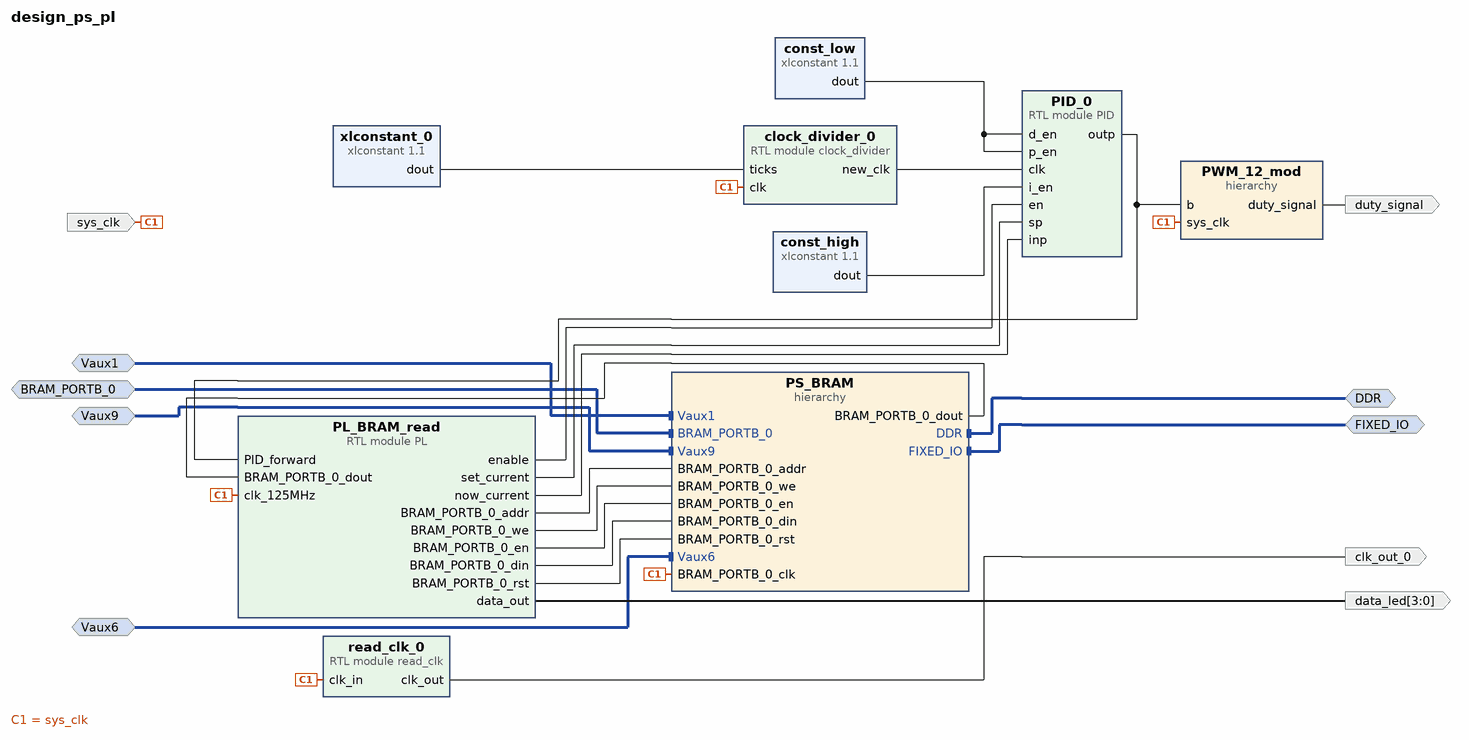
[diagram p0: block diagram of the top level]
# Vivado block design design_ps_pl, xc7z020clg400-1, Vivado 2019.1
create_bd_design design_ps_pl

create_bd_intf_port -mode Slave -vlnv xilinx.com:interface:bram_rtl:1.0 BRAM_PORTB_0
set_property -dict {CONFIG.MASTER_TYPE BRAM_CTRL} [get_bd_intf_ports BRAM_PORTB_0]
create_bd_intf_port -mode Master -vlnv xilinx.com:interface:ddrx_rtl:1.0 DDR
create_bd_intf_port -mode Master -vlnv xilinx.com:display_processing_system7:fixedio_rtl:1.0 FIXED_IO
create_bd_intf_port -mode Slave -vlnv xilinx.com:interface:diff_analog_io_rtl:1.0 Vaux1
create_bd_intf_port -mode Slave -vlnv xilinx.com:interface:diff_analog_io_rtl:1.0 Vaux6
create_bd_intf_port -mode Slave -vlnv xilinx.com:interface:diff_analog_io_rtl:1.0 Vaux9
create_bd_port -dir I sys_clk
create_bd_port -dir O -from 3 -to 0 data_led
create_bd_port -dir O duty_signal
create_bd_port -dir O clk_out_0

create_bd_cell -type hier PS_BRAM
create_bd_cell -type ip -vlnv xilinx.com:ip:xlconstant:1.1 const_high
create_bd_cell -type ip -vlnv xilinx.com:ip:xlconstant:1.1 const_low
set_property -dict {CONFIG.CONST_VAL 0} [get_bd_cells const_low]
create_bd_cell -type hier PWM_12_mod
create_bd_cell -type module -reference PL PL_BRAM_read
create_bd_cell -type module -reference PID PID_0
create_bd_cell -type module -reference read_clk read_clk_0
create_bd_cell -type module -reference clock_divider clock_divider_0
create_bd_cell -type ip -vlnv xilinx.com:ip:xlconstant:1.1 xlconstant_0
set_property -dict {CONFIG.CONST_VAL 4095 CONFIG.CONST_WIDTH 32} [get_bd_cells xlconstant_0]

# ---- hierarchy /PS_BRAM ----
current_bd_instance /PS_BRAM
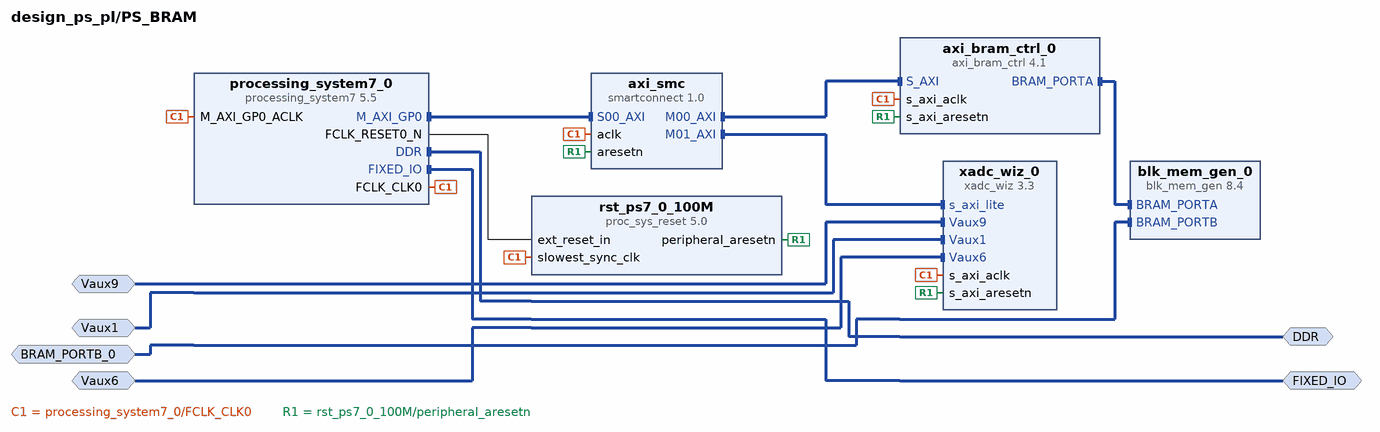
[diagram p1: block diagram inside /PS_BRAM]
create_bd_intf_pin -mode Master -vlnv xilinx.com:interface:ddrx_rtl:1.0 DDR
create_bd_intf_pin -mode Master -vlnv xilinx.com:display_processing_system7:fixedio_rtl:1.0 FIXED_IO
create_bd_intf_pin -mode Slave -vlnv xilinx.com:interface:bram_rtl:1.0 BRAM_PORTB_0
create_bd_intf_pin -mode Slave -vlnv xilinx.com:interface:diff_analog_io_rtl:1.0 Vaux1
create_bd_intf_pin -mode Slave -vlnv xilinx.com:interface:diff_analog_io_rtl:1.0 Vaux6
create_bd_intf_pin -mode Slave -vlnv xilinx.com:interface:diff_analog_io_rtl:1.0 Vaux9

create_bd_cell -type ip -vlnv xilinx.com:ip:axi_bram_ctrl:4.1 axi_bram_ctrl_0
set_property -dict {CONFIG.SINGLE_PORT_BRAM 1} [get_bd_cells axi_bram_ctrl_0]
create_bd_cell -type ip -vlnv xilinx.com:ip:smartconnect:1.0 axi_smc
set_property -dict {CONFIG.NUM_MI 2 CONFIG.NUM_SI 1} [get_bd_cells axi_smc]
create_bd_cell -type ip -vlnv xilinx.com:ip:processing_system7:5.5 processing_system7_0
set_property -dict [list \
  CONFIG.PCW_APU_PERIPHERAL_FREQMHZ 650 \
  CONFIG.PCW_CRYSTAL_PERIPHERAL_FREQMHZ 50 \
  CONFIG.PCW_ENET0_ENET0_IO {MIO 16 .. 27} \
  CONFIG.PCW_ENET0_GRP_MDIO_ENABLE 1 \
  CONFIG.PCW_ENET0_GRP_MDIO_IO {MIO 52 .. 53} \
  CONFIG.PCW_ENET0_PERIPHERAL_ENABLE 1 \
  CONFIG.PCW_ENET0_RESET_ENABLE 1 \
  CONFIG.PCW_ENET0_RESET_IO {MIO 9} \
  CONFIG.PCW_ENET_RESET_ENABLE 1 \
  CONFIG.PCW_ENET_RESET_SELECT {Share reset pin} \
  CONFIG.PCW_FPGA0_PERIPHERAL_FREQMHZ 100 \
  CONFIG.PCW_FPGA1_PERIPHERAL_FREQMHZ 50 \
  CONFIG.PCW_GPIO_MIO_GPIO_ENABLE 1 \
  CONFIG.PCW_GPIO_MIO_GPIO_IO MIO \
  CONFIG.PCW_I2C_RESET_ENABLE 1 \
  CONFIG.PCW_M_AXI_GP0_FREQMHZ 10 \
  CONFIG.PCW_PERIPHERAL_BOARD_PRESET None \
  CONFIG.PCW_PRESET_BANK1_VOLTAGE {LVCMOS 1.8V} \
  CONFIG.PCW_QSPI_GRP_FBCLK_ENABLE 1 \
  CONFIG.PCW_QSPI_GRP_FBCLK_IO {MIO 8} \
  CONFIG.PCW_QSPI_GRP_SINGLE_SS_ENABLE 1 \
  CONFIG.PCW_QSPI_GRP_SINGLE_SS_IO {MIO 1 .. 6} \
  CONFIG.PCW_QSPI_PERIPHERAL_ENABLE 1 \
  CONFIG.PCW_QSPI_QSPI_IO {MIO 1 .. 6} \
  CONFIG.PCW_SD0_GRP_CD_ENABLE 1 \
  CONFIG.PCW_SD0_GRP_CD_IO {MIO 47} \
  CONFIG.PCW_SD0_GRP_WP_ENABLE 0 \
  CONFIG.PCW_SD0_PERIPHERAL_ENABLE 1 \
  CONFIG.PCW_SD0_SD0_IO {MIO 40 .. 45} \
  CONFIG.PCW_SDIO_PERIPHERAL_FREQMHZ 50 \
  CONFIG.PCW_SINGLE_QSPI_DATA_MODE x4 \
  CONFIG.PCW_UART0_PERIPHERAL_ENABLE 1 \
  CONFIG.PCW_UART0_UART0_IO {MIO 14 .. 15} \
  CONFIG.PCW_UART1_PERIPHERAL_ENABLE 0 \
  CONFIG.PCW_UART_PERIPHERAL_FREQMHZ 100 \
  CONFIG.PCW_UIPARAM_DDR_BUS_WIDTH {16 Bit} \
  CONFIG.PCW_UIPARAM_DDR_FREQ_MHZ 525 \
  CONFIG.PCW_UIPARAM_DDR_PARTNO {MT41J256M16 RE-125} \
  CONFIG.PCW_USB0_PERIPHERAL_ENABLE 1 \
  CONFIG.PCW_USB0_RESET_ENABLE 1 \
  CONFIG.PCW_USB0_RESET_IO {MIO 46} \
  CONFIG.PCW_USB0_USB0_IO {MIO 28 .. 39} \
  CONFIG.PCW_USB_RESET_ENABLE 1 \
  CONFIG.PCW_USB_RESET_SELECT {Share reset pin} \
] [get_bd_cells processing_system7_0]
# 481 more settings of processing_system7_0 are not shown: defaults, MIO pin electricals, DDR timing, and values the tool derives
create_bd_cell -type ip -vlnv xilinx.com:ip:blk_mem_gen:8.4 blk_mem_gen_0
set_property -dict [list \
  CONFIG.Enable_B Use_ENB_Pin \
  CONFIG.Memory_Type True_Dual_Port_RAM \
  CONFIG.Port_B_Clock 100 \
  CONFIG.Port_B_Enable_Rate 100 \
  CONFIG.Port_B_Write_Rate 50 \
  CONFIG.Use_RSTB_Pin true \
] [get_bd_cells blk_mem_gen_0]
create_bd_cell -type ip -vlnv xilinx.com:ip:proc_sys_reset:5.0 rst_ps7_0_100M
create_bd_cell -type ip -vlnv xilinx.com:ip:xadc_wiz:3.3 xadc_wiz_0
set_property -dict [list \
  CONFIG.CHANNEL_AVERAGING 16 \
  CONFIG.CHANNEL_ENABLE_VAUXP1_VAUXN1 true \
  CONFIG.CHANNEL_ENABLE_VAUXP6_VAUXN6 true \
  CONFIG.CHANNEL_ENABLE_VAUXP9_VAUXN9 true \
  CONFIG.CHANNEL_ENABLE_VP_VN true \
  CONFIG.ENABLE_VCCDDRO_ALARM false \
  CONFIG.ENABLE_VCCPAUX_ALARM false \
  CONFIG.ENABLE_VCCPINT_ALARM false \
  CONFIG.EXTERNAL_MUX_CHANNEL VP_VN \
  CONFIG.OT_ALARM false \
  CONFIG.SEQUENCER_MODE Continuous \
  CONFIG.SINGLE_CHANNEL_SELECTION TEMPERATURE \
  CONFIG.USER_TEMP_ALARM false \
  CONFIG.VCCAUX_ALARM false \
  CONFIG.VCCINT_ALARM false \
  CONFIG.XADC_STARUP_SELECTION channel_sequencer \
] [get_bd_cells xadc_wiz_0]

# ---- hierarchy /PWM_12_mod ----
current_bd_instance /PWM_12_mod
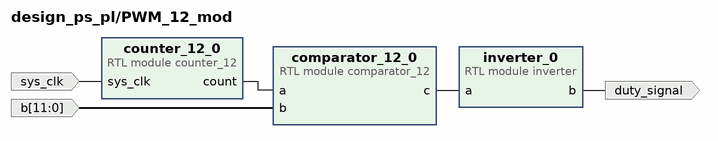
[diagram p2: block diagram inside /PWM_12_mod]
create_bd_pin -dir I -type clk sys_clk
create_bd_pin -dir O duty_signal
create_bd_pin -dir I -from 11 -to 0 b

create_bd_cell -type module -reference counter_12 counter_12_0
create_bd_cell -type module -reference inverter inverter_0
create_bd_cell -type module -reference comparator_12 comparator_12_0

# ---- connections ----

current_bd_instance /PS_BRAM
connect_bd_intf_net [get_bd_intf_pins Vaux9] [get_bd_intf_pins xadc_wiz_0/Vaux9]
connect_bd_intf_net [get_bd_intf_pins axi_smc/M01_AXI] [get_bd_intf_pins xadc_wiz_0/s_axi_lite]
connect_bd_intf_net [get_bd_intf_pins DDR] [get_bd_intf_pins processing_system7_0/DDR]
connect_bd_intf_net [get_bd_intf_pins axi_bram_ctrl_0/BRAM_PORTA] [get_bd_intf_pins blk_mem_gen_0/BRAM_PORTA]
connect_bd_intf_net [get_bd_intf_pins FIXED_IO] [get_bd_intf_pins processing_system7_0/FIXED_IO]
connect_bd_intf_net [get_bd_intf_pins axi_smc/M00_AXI] [get_bd_intf_pins axi_bram_ctrl_0/S_AXI]
connect_bd_intf_net [get_bd_intf_pins processing_system7_0/M_AXI_GP0] [get_bd_intf_pins axi_smc/S00_AXI]
connect_bd_intf_net [get_bd_intf_pins Vaux1] [get_bd_intf_pins xadc_wiz_0/Vaux1]
connect_bd_intf_net -intf_net BRAM_PORTB_0_1 [get_bd_intf_pins BRAM_PORTB_0] [get_bd_intf_pins blk_mem_gen_0/BRAM_PORTB]
connect_bd_intf_net [get_bd_intf_pins Vaux6] [get_bd_intf_pins xadc_wiz_0/Vaux6]
connect_bd_net [get_bd_pins processing_system7_0/FCLK_CLK0] \
  [get_bd_pins processing_system7_0/M_AXI_GP0_ACLK] [get_bd_pins axi_smc/aclk] [get_bd_pins axi_bram_ctrl_0/s_axi_aclk] \
  [get_bd_pins rst_ps7_0_100M/slowest_sync_clk] [get_bd_pins xadc_wiz_0/s_axi_aclk]
connect_bd_net [get_bd_pins rst_ps7_0_100M/peripheral_aresetn] \
  [get_bd_pins axi_bram_ctrl_0/s_axi_aresetn] [get_bd_pins axi_smc/aresetn] [get_bd_pins xadc_wiz_0/s_axi_aresetn]
connect_bd_net [get_bd_pins processing_system7_0/FCLK_RESET0_N] [get_bd_pins rst_ps7_0_100M/ext_reset_in]
set_property HDL_ATTRIBUTE.BMM_INFO_ADDRESS_SPACE {byte  0x40000000 32 > design_ps_pl PS_BRAM/blk_mem_gen_0} [get_bd_cells axi_bram_ctrl_0]
set_property HDL_ATTRIBUTE.KEEP_HIERARCHY yes [get_bd_cells axi_bram_ctrl_0]
set_property HDL_ATTRIBUTE.BMM_INFO_PROCESSOR {arm > design_ps_pl PS_BRAM/axi_bram_ctrl_0} [get_bd_cells processing_system7_0]
set_property HDL_ATTRIBUTE.KEEP_HIERARCHY yes [get_bd_cells processing_system7_0]

current_bd_instance /PWM_12_mod
connect_bd_net [get_bd_pins counter_12_0/count] [get_bd_pins comparator_12_0/a]
connect_bd_net [get_bd_pins comparator_12_0/c] [get_bd_pins inverter_0/a]
connect_bd_net -net clk_125MHz_0_1 [get_bd_pins sys_clk] [get_bd_pins counter_12_0/sys_clk]
connect_bd_net [get_bd_pins inverter_0/b] [get_bd_pins duty_signal]
connect_bd_net -net PID_0_outp [get_bd_pins b] [get_bd_pins comparator_12_0/b]

current_bd_instance /
connect_bd_intf_net -intf_net processing_system7_0_DDR [get_bd_intf_ports DDR] [get_bd_intf_pins PS_BRAM/DDR]
connect_bd_intf_net -intf_net processing_system7_0_FIXED_IO [get_bd_intf_ports FIXED_IO] [get_bd_intf_pins PS_BRAM/FIXED_IO]
connect_bd_intf_net -intf_net Vaux1_1 [get_bd_intf_ports Vaux1] [get_bd_intf_pins PS_BRAM/Vaux1]
connect_bd_intf_net -intf_net BRAM_PORTB_0_1 [get_bd_intf_ports BRAM_PORTB_0] [get_bd_intf_pins PS_BRAM/BRAM_PORTB_0]
connect_bd_intf_net -intf_net Vaux9_1 [get_bd_intf_ports Vaux9] [get_bd_intf_pins PS_BRAM/Vaux9]
connect_bd_intf_net -intf_net Vaux6_1 [get_bd_intf_ports Vaux6] [get_bd_intf_pins PS_BRAM/Vaux6]
connect_bd_net -net ps_BRAM_PORTB_0_dout [get_bd_pins PS_BRAM/BRAM_PORTB_0_dout] [get_bd_pins PL_BRAM_read/BRAM_PORTB_0_dout]
connect_bd_net -net PL_0_BRAM_PORTB_0_addr [get_bd_pins PL_BRAM_read/BRAM_PORTB_0_addr] [get_bd_pins PS_BRAM/BRAM_PORTB_0_addr]
connect_bd_net -net clk_125MHz_0_1 [get_bd_ports sys_clk] \
  [get_bd_pins PS_BRAM/BRAM_PORTB_0_clk] [get_bd_pins PWM_12_mod/sys_clk] [get_bd_pins PL_BRAM_read/clk_125MHz] \
  [get_bd_pins read_clk_0/clk_in] [get_bd_pins clock_divider_0/clk]
connect_bd_net -net BRAM_PORTB_0_we_1 [get_bd_pins PL_BRAM_read/BRAM_PORTB_0_we] [get_bd_pins PS_BRAM/BRAM_PORTB_0_we]
connect_bd_net -net PL_0_data_out [get_bd_pins PL_BRAM_read/data_out] [get_bd_ports data_led]
connect_bd_net -net PL_0_BRAM_PORTB_0_en [get_bd_pins PL_BRAM_read/BRAM_PORTB_0_en] [get_bd_pins PS_BRAM/BRAM_PORTB_0_en]
connect_bd_net -net BRAM_PORTB_0_din_1 [get_bd_pins PL_BRAM_read/BRAM_PORTB_0_din] [get_bd_pins PS_BRAM/BRAM_PORTB_0_din]
connect_bd_net -net BRAM_PORTB_0_rst_1 [get_bd_pins PL_BRAM_read/BRAM_PORTB_0_rst] [get_bd_pins PS_BRAM/BRAM_PORTB_0_rst]
connect_bd_net [get_bd_pins PL_BRAM_read/enable] [get_bd_pins PID_0/en]
connect_bd_net [get_bd_pins PL_BRAM_read/set_current] [get_bd_pins PID_0/sp]
connect_bd_net [get_bd_pins PL_BRAM_read/now_current] [get_bd_pins PID_0/inp]
connect_bd_net -net xlconstant_1_dout [get_bd_pins const_low/dout] [get_bd_pins PID_0/p_en] [get_bd_pins PID_0/d_en]
connect_bd_net -net inverter_0_b [get_bd_pins PWM_12_mod/duty_signal] [get_bd_ports duty_signal]
connect_bd_net [get_bd_pins PID_0/outp] [get_bd_pins PWM_12_mod/b] [get_bd_pins PL_BRAM_read/PID_forward]
connect_bd_net [get_bd_pins read_clk_0/clk_out] [get_bd_ports clk_out_0]
connect_bd_net [get_bd_pins const_high/dout] [get_bd_pins PID_0/i_en]
connect_bd_net [get_bd_pins clock_divider_0/new_clk] [get_bd_pins PID_0/clk]
connect_bd_net [get_bd_pins xlconstant_0/dout] [get_bd_pins clock_divider_0/ticks]

# ---- address map ----
assign_bd_address -offset 0x40000000 -range 8K -target_address_space [get_bd_addr_spaces PS_BRAM/processing_system7_0/Data] [get_bd_addr_segs PS_BRAM/axi_bram_ctrl_0/S_AXI/Mem0]
assign_bd_address -offset 0x43C00000 -range 64K -target_address_space [get_bd_addr_spaces PS_BRAM/processing_system7_0/Data] [get_bd_addr_segs PS_BRAM/xadc_wiz_0/s_axi_lite/Reg]

validate_bd_design
save_bd_design
